# EAGLE design MrAdapteur (EAGLE 6.5.0)
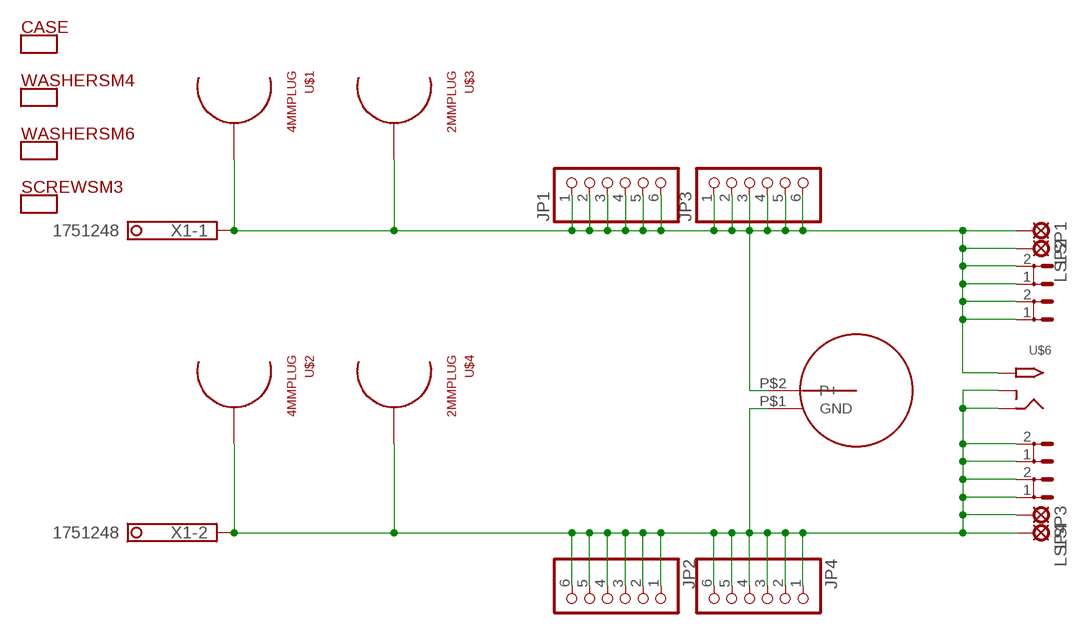
[diagram p0: schematic, sheet 1]
CASE (DUMMY): OC_TME: CP-Z-75/B; PRICE_10: 0.688

## Parts
JP1  PINHD-1X6  [1X06]
JP2  PINHD-1X6  [1X06]
JP3  PINHD-1X6  [1X06]
JP4  PINHD-1X6  [1X06]
LSP1  LSP11  [LSP11]
LSP2  LSP11  [LSP11]
LSP3  LSP11  [LSP11]
LSP4  LSP11  [LSP11]
U$1  4MMPLUG  [4MMPLUG]
U$2  4MMPLUG  [4MMPLUG]
U$3  2MMPLUG  [2MMPLUG]
U$4  2MMPLUG  [2MMPLUG]
U$5  BNC  [BNC]
U$6  2.1MMJACKTHM  [PJ-102A]
X1  1751248  [1751248]
X3  ST4,8  [ST4,8]
X4  ST4,8  [ST4,8]
X5  ST4,8  [ST4,8]
X6  ST4,8  [ST4,8]

## Nets
N$1: JP1.1 JP1.2 JP1.3 JP1.4 JP1.5 JP1.6 JP3.1 JP3.2 JP3.3 JP3.4 JP3.5 JP3.6 LSP1.MP LSP2.MP U$1.P$1 U$3.P$1 U$5.P$2(P+) U$6.TIP X1.1 X3.1 X3.2 X5.1 X5.2
N$3: JP2.1 JP2.2 JP2.3 JP2.4 JP2.5 JP2.6 JP4.1 JP4.2 JP4.3 JP4.4 JP4.5 JP4.6 LSP3.MP LSP4.MP U$2.P$1 U$4.P$1 U$5.P$1(GND) U$6.RING U$6.RING_SW X1.2 X4.1 X4.2 X6.1 X6.2

## Library data of the parts
JP1 JP2 = pinhead:PINHD-1X6: PIN HEADER; OC_TME: ZL201-06G; PRICE_25: 0.045
JP3 JP4 = pinhead:PINHD-1X6: PIN HEADER; OC_TME: ZL262-6SG; PRICE_10: 0.114
LSP1-LSP4 = solpad:LSP11: SOLDER PAD drill 1.1 mm
U$1 = 4mm:4MMPLUG; OC_REICHELT: BB 4 SW; PRICE_10: 0.3
U$2 = 4mm:4MMPLUG; OC_REICHELT: BB 4 RT; PRICE_10: 0.3
U$3 = 4mm:2MMPLUG; OC_TME: BS-102S-B; PRICE_10: 0.32
U$4 = 4mm:2MMPLUG; OC_TME: BS-102S-R; PRICE_10: 0.32
U$5 = 4mm:BNC; OC_TME: BNC-208; PRICE_10: 0.573
U$6 = adafruit:2.1MMJACK: 2.1mm x 5.5mm THM DC jack with internal switch. Digikey part #PJ-102A, 4UCON part #05537 2.1mm x 5.5mm SMT DC jack with internal switch. Digikey part #PJ-002A-SMT, 4UCON part #03267 By microbuilder.eu & adafruit.com; OC_TME: PC-GK2.1; PRICE_10: 0.167
X1 = con-phoenix-350:1751248: MKDS 1/ 2-3,5 Printklemme Nennstrom: 10 A Bemessungsspannung: 160 V Raster: 3,5 mm Polzahl: 2 Montageart: Löten Anschlussart: Schraubanschluss Anschlussrichtung vom Leiter zur Platine: 0° Source: http://eshop.phoenixcontact.com .. 1751248.pdf; OC_FARNELL: unknown; OC_NEWARK: unknown; OC_TME: TB-3.5-P-2P/BL; PRICE_10: 0.155
X3 X4 = con-rib:ST4,8: RIBBON CABLE CONNECTOR Flachstecker / Faston; OC_FARNELL: unknown; OC_NEWARK: unknown; OC_REICHELT: FS-P 4,75; PRICE_10: 0.04
X5 X6 = con-rib:ST4,8: RIBBON CABLE CONNECTOR Flachstecker / Faston; OC_FARNELL: unknown; OC_NEWARK: unknown; OC_REICHELT: FS-P 6,35; PRICE_10: 0.05

## Board
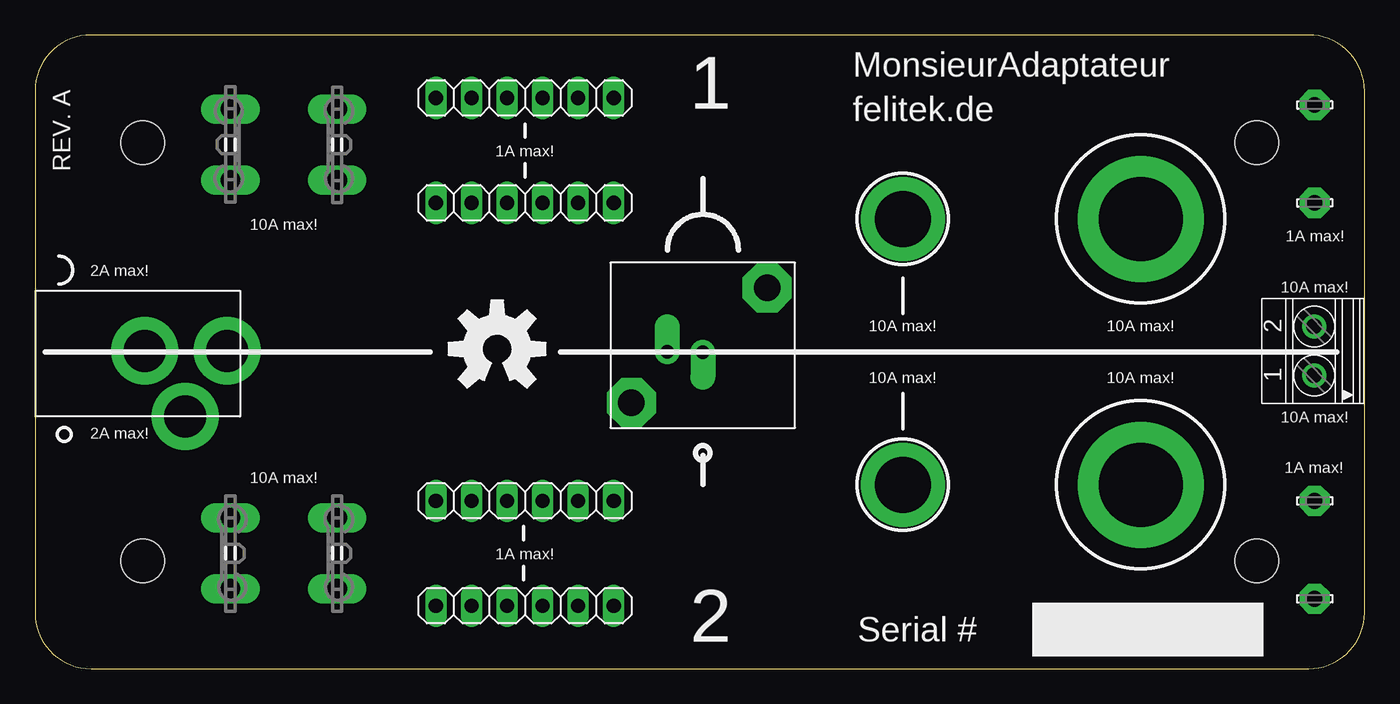
[diagram p1: board, top side]
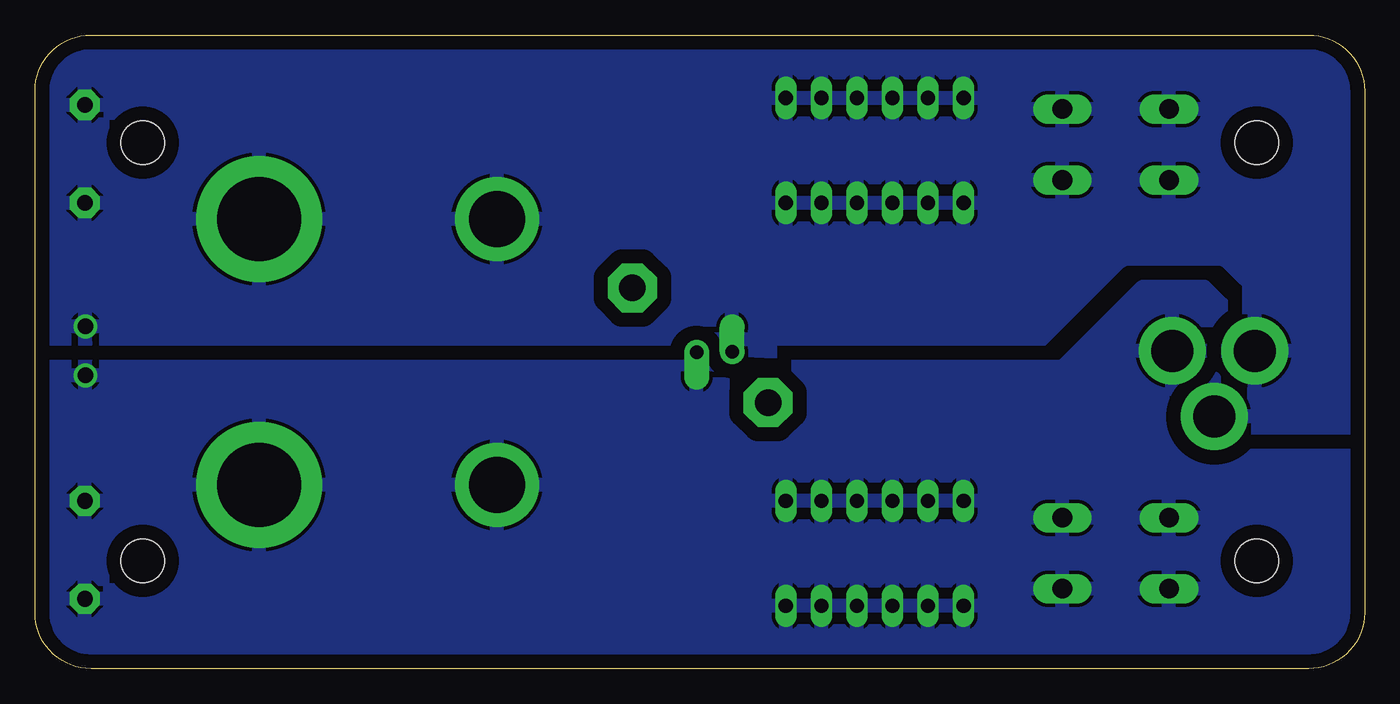
[diagram p2: board, bottom side, seen from below]

Size 95 x 45.3 mm. Coordinates in mm from the lower left corner, seen from the top.
Outline: 0,4 arc90 4,0 91,0 arc90 95,4 95,41.3 arc90 91,45.3 4,45.3 arc90 0,41.3 0,4
Copper layers (1*16): Top 0.035mm / dielectric 1.5mm / Bottom 0.035mm
Design rules "default": minimum track width 10mil, minimum drill 24mil, track to track 8mil, track to pad 8mil, pad to pad 8mil, via to via 8mil, smd to smd 8mil, copper to edge 40mil, drill to drill 8mil, minimum pad ring 10mil, minimum via ring 8mil, stop-mask expansion 4mil, vias tented up to drill 0mil, thermal gap 10mil
Holes 3.1 mm at 87.3,7.7 7.7,7.7 7.7,37.6 87.3,37.6

### Footprints (pad centres in the part's own frame; a part is rotated, then mirrored left to right if it is on the bottom)
1X06 = drill 1.016 long: 1 -6.35,0; 2 -3.81,0; 3 -1.27,0; 4 1.27,0; 5 3.81,0; 6 6.35,0
LSP11 = drill 1.118 pad 2.159 octagon: MP 0,0
4MMPLUG = drill 6 pad 9: P$1 0,0
2MMPLUG = drill 4 pad 6: P$1 0,0
BNC = drill 0.95 pad 1.778 offset: P$1 -2.54,0.04; P$2 0,0 | drill 1.9 pad 3.5 octagon: P$3 -5.1,-3.6; P$4 4.6,4.6
PJ-102A = drill 3 pad 4.8: RING 0.1,-3.39; RING_SW -4.6,-6.29; TIP 0.1,-9.29
1751248 = drill 1.1 pad 1.7: 1 -1.75,-0.1; 2 1.75,-0.1
ST4,8 = drill 1.397 long: 1 -2.54,0; 2 2.54,0

### Placement (x,y rotation side)
JP1  35,4.5 0 top
JP2  35,33.3 0 top
JP3  35,12 0 top
JP4  35,40.8 0 top
LSP1  91.44,5 0 top
LSP2  91.44,12 0 top
LSP3  91.44,40.3 0 top
LSP4  91.44,33.3 0 top
U$1  79,13.15 0 top
U$2  79,32.15 0 top
U$3  62,13.15 0 top
U$4  62,32.15 0 top
U$5  47.72,22.62 0 top
U$6  4.45,22.62 90 top
U$7  [OSHW-LOGO-L]  33.02,22.86 0 top
X1  91.3,22.72 90 top
X3  21.59,8.26 270 top
X4  13.97,37.47 90 top
X5  13.97,8.26 270 top
X6  21.59,37.47 270 top

### Tracks (layer width: path | path; a pad name or v marks a point on that pad's centre or on a via)
N$1
  pour Bottom (isolate 1.016): 95.25,21.59 21.59,21.59 15.88,27.3 11.43,27.3 10.16,26.04 10.16,22.23 13.34,17.78 13.34,15.24 0,15.24 0,2.54 2.54,0 45,0 68,0 92.71,0 95.25,2.54
N$3
  pour Bottom (isolate 1.016, rank 2): 12.7,16.51 0.64,16.51 0.64,43.18 2.54,45.09 92.71,45.09 95.25,42.55 95.25,22.86 50.16,22.86 48.9,24.13 46.99,24.13 45.72,22.86 20.32,21.59 15.88,27.3 12.06,27.3 10.16,25.4 10.16,22.86 13.34,18.41 13.34,17.14

### Text on the board
tNames: MonsieurAdaptateur | 1 | felitek.de | 1A max! | REV. A | 10A max! | 1A max! | 2A max! | 10A max! | 10A max! | 10A max! | 10A max! | 10A max! | 10A max! | 2A max! | 10A max! | 1A max! | 1A max! | 2 | Serial #